# Altium schematic sheet Top.SchDoc
size A3; DrawnBy: 23; Address4: Top; SheetNumber: 1; SheetTotal: 9
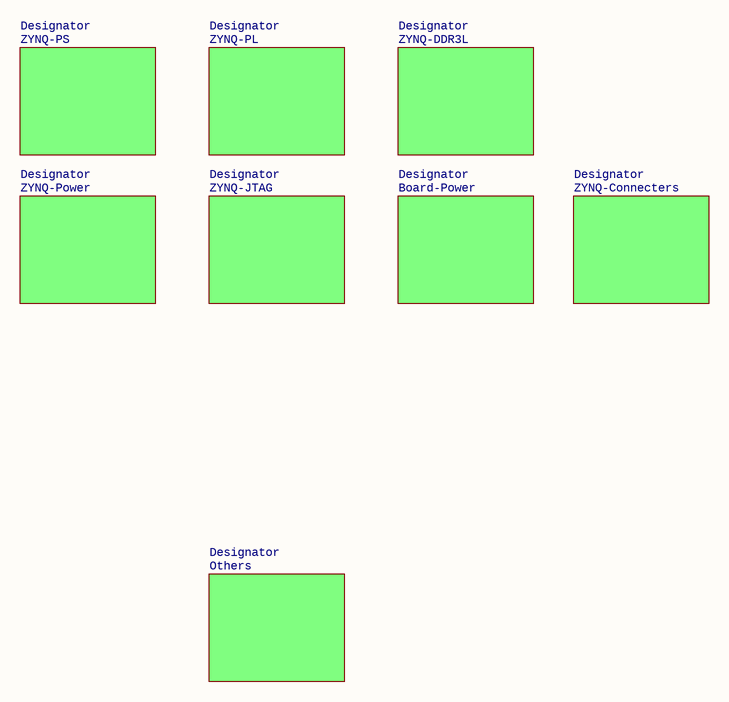
[diagram p0: Top.SchDoc]

## Sub-sheets
Designator = ZYNQ-PS: no entries
Designator = ZYNQ-Power: no entries
Designator = ZYNQ-PL: no entries
Designator = ZYNQ-DDR3L: no entries
Designator = ZYNQ-JTAG: no entries
Designator = Board-Power: no entries
Designator = Others: no entries
Designator = ZYNQ-Connecters: no entries